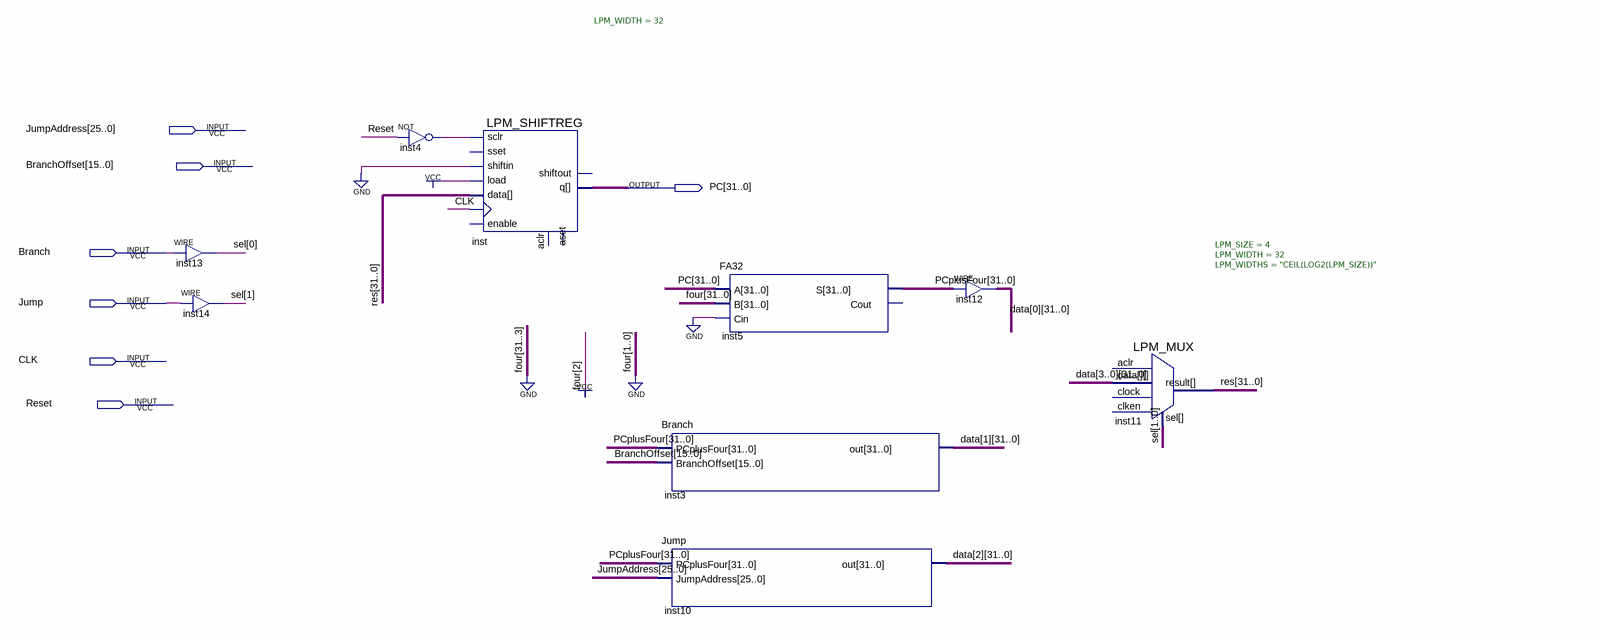
[diagram p0: schematic sheet]
// Quartus schematic PCMIPS.bdf as structural Verilog: 9 symbols, 7 pins
module PCMIPS (
  input  [25:0] JumpAddress,
  input  [15:0] BranchOffset,
  input  Branch,
  input  Jump,
  input  CLK,
  input  Reset,
  output [31:0] PC
);

  wire inst4_out;
  wire [1:0] sel;
  wire [31:0] data_0, data_1, data_2, data_3, PCplusFour, res;

  assign sel[0] = Branch;  // WIRE inst13
  assign sel[1] = Jump;  // WIRE inst14
  not inst4 (inst4_out, Reset);
  LPM_SHIFTREG #(.LPM_WIDTH(32)) inst (
    .shiftin(1'b0), .clock(CLK), .data(res), .load(1'b1), .sclr(inst4_out), .q(PC));  // open: sset, enable, aset, aclr, shiftout
  Branch inst3 (.PCplusFour(PCplusFour), .BranchOffset(BranchOffset), .out(data_1));
  Jump inst10 (.PCplusFour(PCplusFour), .JumpAddress(JumpAddress), .out(data_2));
  FA32 inst5 (.A(PC), .B(32'b00000000000000000000000000000100), .Cin(1'b0), .S(PCplusFour));  // open: Cout
  assign data_0 = PCplusFour;  // WIRE inst12
  LPM_MUX #(.LPM_SIZE(4), .LPM_WIDTH(32), .LPM_WIDTHS("CEIL(LOG2(LPM_SIZE))")) inst11 (
    .data({data_3, data_2, data_1, data_0}), .sel(sel), .result(res));  // open: clock, aclr, clken
endmodule
